# Altium schematic sheet Sheet1.SchDoc
size A; SheetNumber: 1; SheetTotal: 2
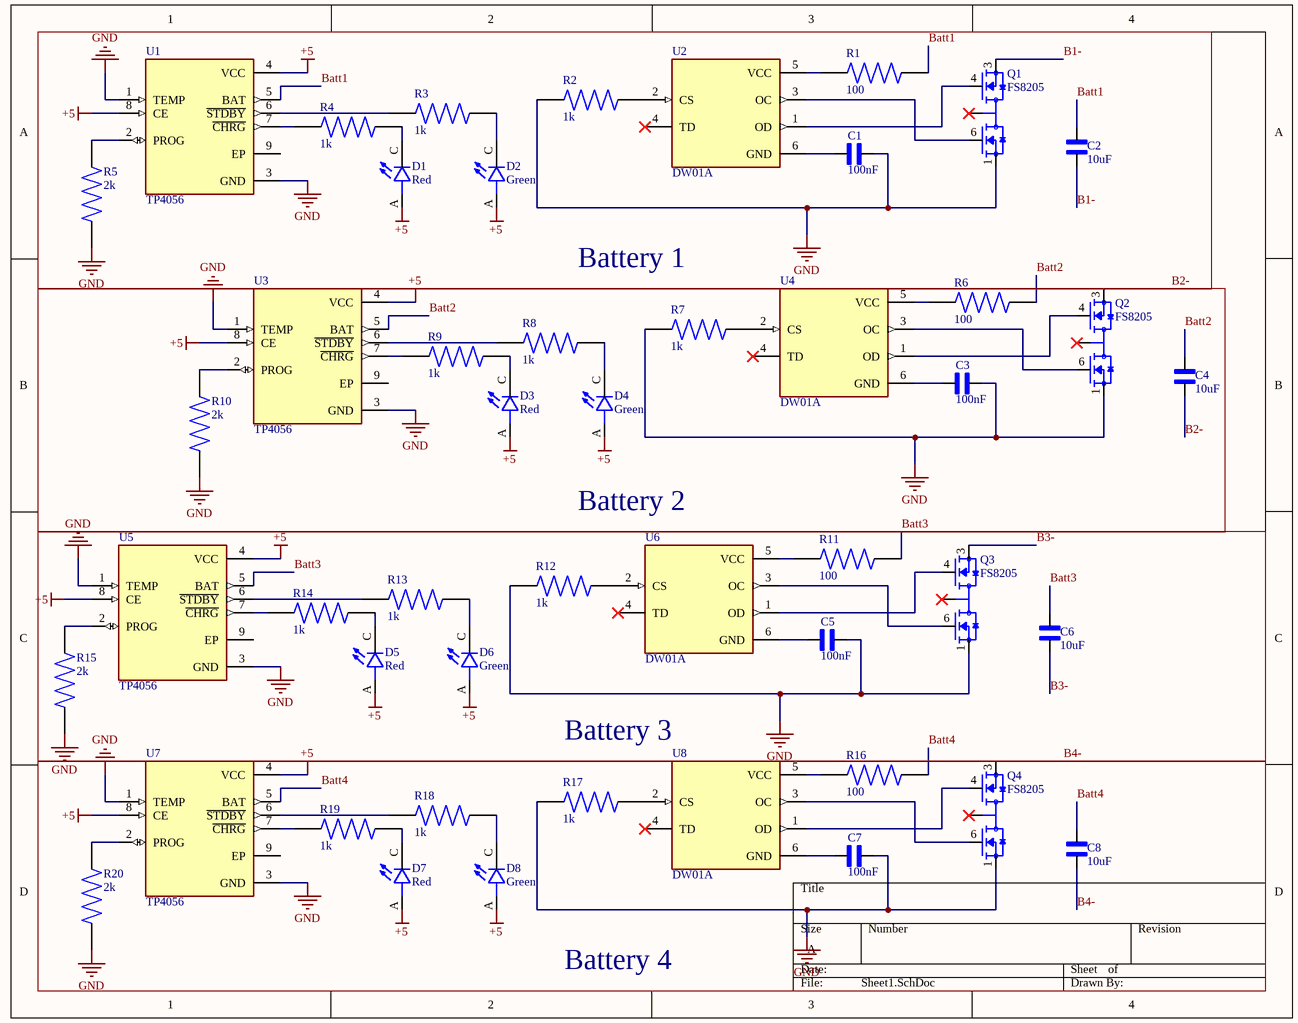
[diagram p0: Sheet1.SchDoc]

## Parts
C1  100nF  [CAPC1608X90N]
C2  10uF  [CAPC1608X90N]
C3  100nF  [CAPC1608X90N]
C4  10uF  [CAPC1608X90N]
C5  100nF  [CAPC1608X90N]
C6  10uF  [CAPC1608X90N]
C7  100nF  [CAPC1608X90N]
C8  10uF  [CAPC1608X90N]
D1  Red  [LED_SML-D12U1WT86]
D2  Green  [LED_SML-D12FWT86]
D3  Red  [LED_SML-D12U1WT86]
D4  Green  [LED_SML-D12FWT86]
D5  Red  [LED_SML-D12U1WT86]
D6  Green  [LED_SML-D12FWT86]
D7  Red  [LED_SML-D12U1WT86]
D8  Green  [LED_SML-D12FWT86]
Q1  FS8205  [SOT95P280X145-6N]
Q2  FS8205  [SOT95P280X145-6N]
Q3  FS8205  [SOT95P280X145-6N]
Q4  FS8205  [SOT95P280X145-6N]
R1  100  [RES_ERJ3EKF4703V]
R2  1k  [RES_ERJ3EKF4703V]
R3  1k  [RES_ERJ3EKF4703V]
R4  1k  [RES_ERJ3EKF4703V]
R5  2k  [RES_ERJ3EKF4703V]
R6  100  [RES_ERJ3EKF4703V]
R7  1k  [RES_ERJ3EKF4703V]
R8  1k  [RES_ERJ3EKF4703V]
R9  1k  [RES_ERJ3EKF4703V]
R10  2k  [RES_ERJ3EKF4703V]
R11  100  [RES_ERJ3EKF4703V]
R12  1k  [RES_ERJ3EKF4703V]
R13  1k  [RES_ERJ3EKF4703V]
R14  1k  [RES_ERJ3EKF4703V]
R15  2k  [RES_ERJ3EKF4703V]
R16  100  [RES_ERJ3EKF4703V]
R17  1k  [RES_ERJ3EKF4703V]
R18  1k  [RES_ERJ3EKF4703V]
R19  1k  [RES_ERJ3EKF4703V]
R20  2k  [RES_ERJ3EKF4703V]
U1  TP4056  [SOP127P600X175-9N]
U2  DW01A  [SOT95P280X145-6N]
U3  TP4056  [SOP127P600X175-9N]
U4  DW01A  [SOT95P280X145-6N]
U5  TP4056  [SOP127P600X175-9N]
U6  DW01A  [SOT95P280X145-6N]
U7  TP4056  [SOP127P600X175-9N]
U8  DW01A  [SOT95P280X145-6N]

## Blocks framed on the sheet
Battery 1: C1 C2 D1 D2 Q1 R1-R5 U1 U2

## Nets
+5: D1.A D2.A D3.A D4.A D5.A D6.A D7.A D8.A U1.4(VCC) U1.8(CE) U3.4(VCC) U3.8(CE) U5.4(VCC) U5.8(CE) U7.4(VCC) U7.8(CE)
GND: C1.2 C3.2 C5.2 C7.2 Q1.1(S1) Q2.1(S1) Q3.1(S1) Q4.1(S1) R2.1 R5.1 R7.1 R10.1 R12.1 R15.1 R17.1 R20.1 U1.1(TEMP) U1.3(GND) U3.1(TEMP) U3.3(GND) U5.1(TEMP) U5.3(GND) U7.1(TEMP) U7.3(GND)
B1-: C2.1 Q1.3(S2)
B2-: C4.1 Q2.3(S2)
B3-: C6.1 Q3.3(S2)
B4-: C8.1 Q4.3(S2)
Batt1: C2.2 R1.2 U1.5(BAT)
Batt2: C4.2 R6.2 U3.5(BAT)
Batt3: C6.2 R11.2 U5.5(BAT)
Batt4: C8.2 R16.2 U7.5(BAT)
NetC1_1: C1.1 U2.6(GND)
NetC3_1: C3.1 U4.6(GND)
NetC5_1: C5.1 U6.6(GND)
NetC7_1: C7.1 U8.6(GND)
NetD1_C: D1.C R4.2
NetD2_C: D2.C R3.2
NetD3_C: D3.C R9.2
NetD4_C: D4.C R8.2
NetD5_C: D5.C R14.2
NetD6_C: D6.C R13.2
NetD7_C: D7.C R19.2
NetD8_C: D8.C R18.2
NetQ1_2: Q1.2(D12) Q1.5(D12)
NetQ1_4: Q1.4(G2) U2.1(OD)
NetQ1_6: Q1.6(G1) U2.3(OC)
NetQ2_2: Q2.2(D12) Q2.5(D12)
NetQ2_4: Q2.4(G2) U4.1(OD)
NetQ2_6: Q2.6(G1) U4.3(OC)
NetQ3_2: Q3.2(D12) Q3.5(D12)
NetQ3_4: Q3.4(G2) U6.1(OD)
NetQ3_6: Q3.6(G1) U6.3(OC)
NetQ4_2: Q4.2(D12) Q4.5(D12)
NetQ4_4: Q4.4(G2) U8.1(OD)
NetQ4_6: Q4.6(G1) U8.3(OC)
NetR1_1: R1.1 U2.5(VCC)
NetR2_2: R2.2 U2.2(CS)
NetR3_1: R3.1 U1.6(~{STDBY})
NetR4_1: R4.1 U1.7(~{CHRG})
NetR5_2: R5.2 U1.2(PROG)
NetR6_1: R6.1 U4.5(VCC)
NetR7_2: R7.2 U4.2(CS)
NetR8_1: R8.1 U3.6(~{STDBY})
NetR9_1: R9.1 U3.7(~{CHRG})
NetR10_2: R10.2 U3.2(PROG)
NetR11_1: R11.1 U6.5(VCC)
NetR12_2: R12.2 U6.2(CS)
NetR13_1: R13.1 U5.6(~{STDBY})
NetR14_1: R14.1 U5.7(~{CHRG})
NetR15_2: R15.2 U5.2(PROG)
NetR16_1: R16.1 U8.5(VCC)
NetR17_2: R17.2 U8.2(CS)
NetR18_1: R18.1 U7.6(~{STDBY})
NetR19_1: R19.1 U7.7(~{CHRG})
NetR20_2: R20.2 U7.2(PROG)

Not connected (* = marked no-connect by the designer): U1 9(EP); U2 4(TD)*; U3 9(EP); U4 4(TD)*; U5 9(EP); U6 4(TD)*; U7 9(EP); U8 4(TD)*

## Notes on the sheet
- Battery 2
- (near U8) Battery 3
- Battery 4

## Library data of the parts
C1-C8 = 0603YC104KAZ2A: Capacitor MLCC 0603 100nF 16V | AVX 0603YC104KAZ2A; SnapEDA_Link: https://www.snapeda.com/parts/0603YC104KAZ2A/AVX/view-part/?ref=snap; Package: 1608 AVX; Value: *; MF: AVX; MP: 0603YC104KAZ2A; Check_prices: https://www.snapeda.com/parts/0603YC104KAZ2A/AVX/view-part/?ref=eda
D1 D3 D5 D7 = SML-D12U1WT86: Red 620nm LED Indication - Discrete 2.2V 0603 (1608 Metric); MF: Rohm; Package: 0603 Rohm; Price: None; Check_prices: https://www.snapeda.com/parts/SML-D12U1WT86/Rohm/view-part/?ref=eda; Value: *; SnapEDA_Link: https://www.snapeda.com/parts/SML-D12U1WT86/Rohm/view-part/?ref=snap; MP: SML-D12U1WT86; Availability: In Stock; Purchase-URL: https://pricing.snapeda.com/search?q=SML-D12U1WT86&ref=eda
D2 D4 D6 D8 = SML-D12FWT86: Green 565nm LED Indication - Discrete 2.2V 0603 (1608 Metric); MF: Rohm; Price: None; Availability: In Stock; MP: SML-D12FWT86; Package: 0603 Rohm; SnapEDA_Link: https://www.snapeda.com/parts/SML-D12FWT86/Rohm/view-part/?ref=snap; Check_prices: https://www.snapeda.com/parts/SML-D12FWT86/Rohm/view-part/?ref=eda; Value: *; Purchase-URL: https://pricing.snapeda.com/search/part/SML-D12FWT86/?ref=eda
Q1-Q4 = FS8205: ÐœÐžÐŸ-Ñ‚Ñ€Ð°Ð½Ð·Ð¸ÑÑ‚Ð¾Ñ€ Ñ Ð´Ð²Ð¾Ð¹Ð½Ñ‹Ð¼ N-ÐºÐ°Ð½Ð°Ð»ÑŒÐ½Ñ‹Ð¼ Ñ€ÐµÐ¶Ð¸Ð¼Ð¾Ð¼ ÑƒÑÐ¸Ð»ÐµÐ½Ð¸Ñ Ð¼Ð¾Ñ‰Ð½Ð¾ÑÑ‚Ð¸; MF: Fortune Semiconductor; SnapEDA_Link: https://www.snapeda.com/parts/FS8205/Fortune+Semiconductor/view-part/?ref=snap; Package: Package; Value: *; MP: FS8205; Check_prices: https://www.snapeda.com/parts/FS8205/Fortune+Semiconductor/view-part/?ref=eda
R1-R20 = ERJ3EKF4703V: RES, THICK FILM, 470K, 100mW, 1%, 0603RES, THICK FILM, 470K, 100mW, 1%, 0603, FULL REEL; MF: Panasonic; MP: ERJ-3EKF4703V; SnapEDA_Link: https://www.snapeda.com/parts/ERJ-3EKF4703V/Panasonic+Electronic+Components/view-part/?ref=snap; Package: 1608-2 Panasonic; Value: *; Check_prices: https://www.snapeda.com/parts/ERJ-3EKF4703V/Panasonic+Electronic+Components/view-part/?ref=eda
U1 U3 U5 U7 = TP4056: Complete single cell Li-Ion battery with a constant current / constant voltage linear charger; MF: NanJing Top Power ASIC Corp.; Check_prices: https://www.snapeda.com/parts/TP4056/NanJing+Top+Power+ASIC+Corp./view-part/?ref=eda; SnapEDA_Link: https://www.snapeda.com/parts/TP4056/NanJing+Top+Power+ASIC+Corp./view-part/?ref=snap; Price: None; Availability: Not in stock; Package: Package; MP: TP4056; Value: *
U2 U4 U6 U8 = DW01A: One Cell Lithium-ion/Polymer Battery Protection IC; MF: Fortune Semiconductor; SnapEDA_Link: https://www.snapeda.com/parts/DW01A/Fortune+Semiconductor/view-part/?ref=snap; Package: SOT-23-6 Fortune Semiconductor; Value: *; MP: DW01A; Check_prices: https://www.snapeda.com/parts/DW01A/Fortune+Semiconductor/view-part/?ref=eda